# Altium schematic sheet [04] - REVISION HISTORY.SchDoc
size A3; DocumentNumber: 4; SheetNumber: 4; SheetTotal: 5
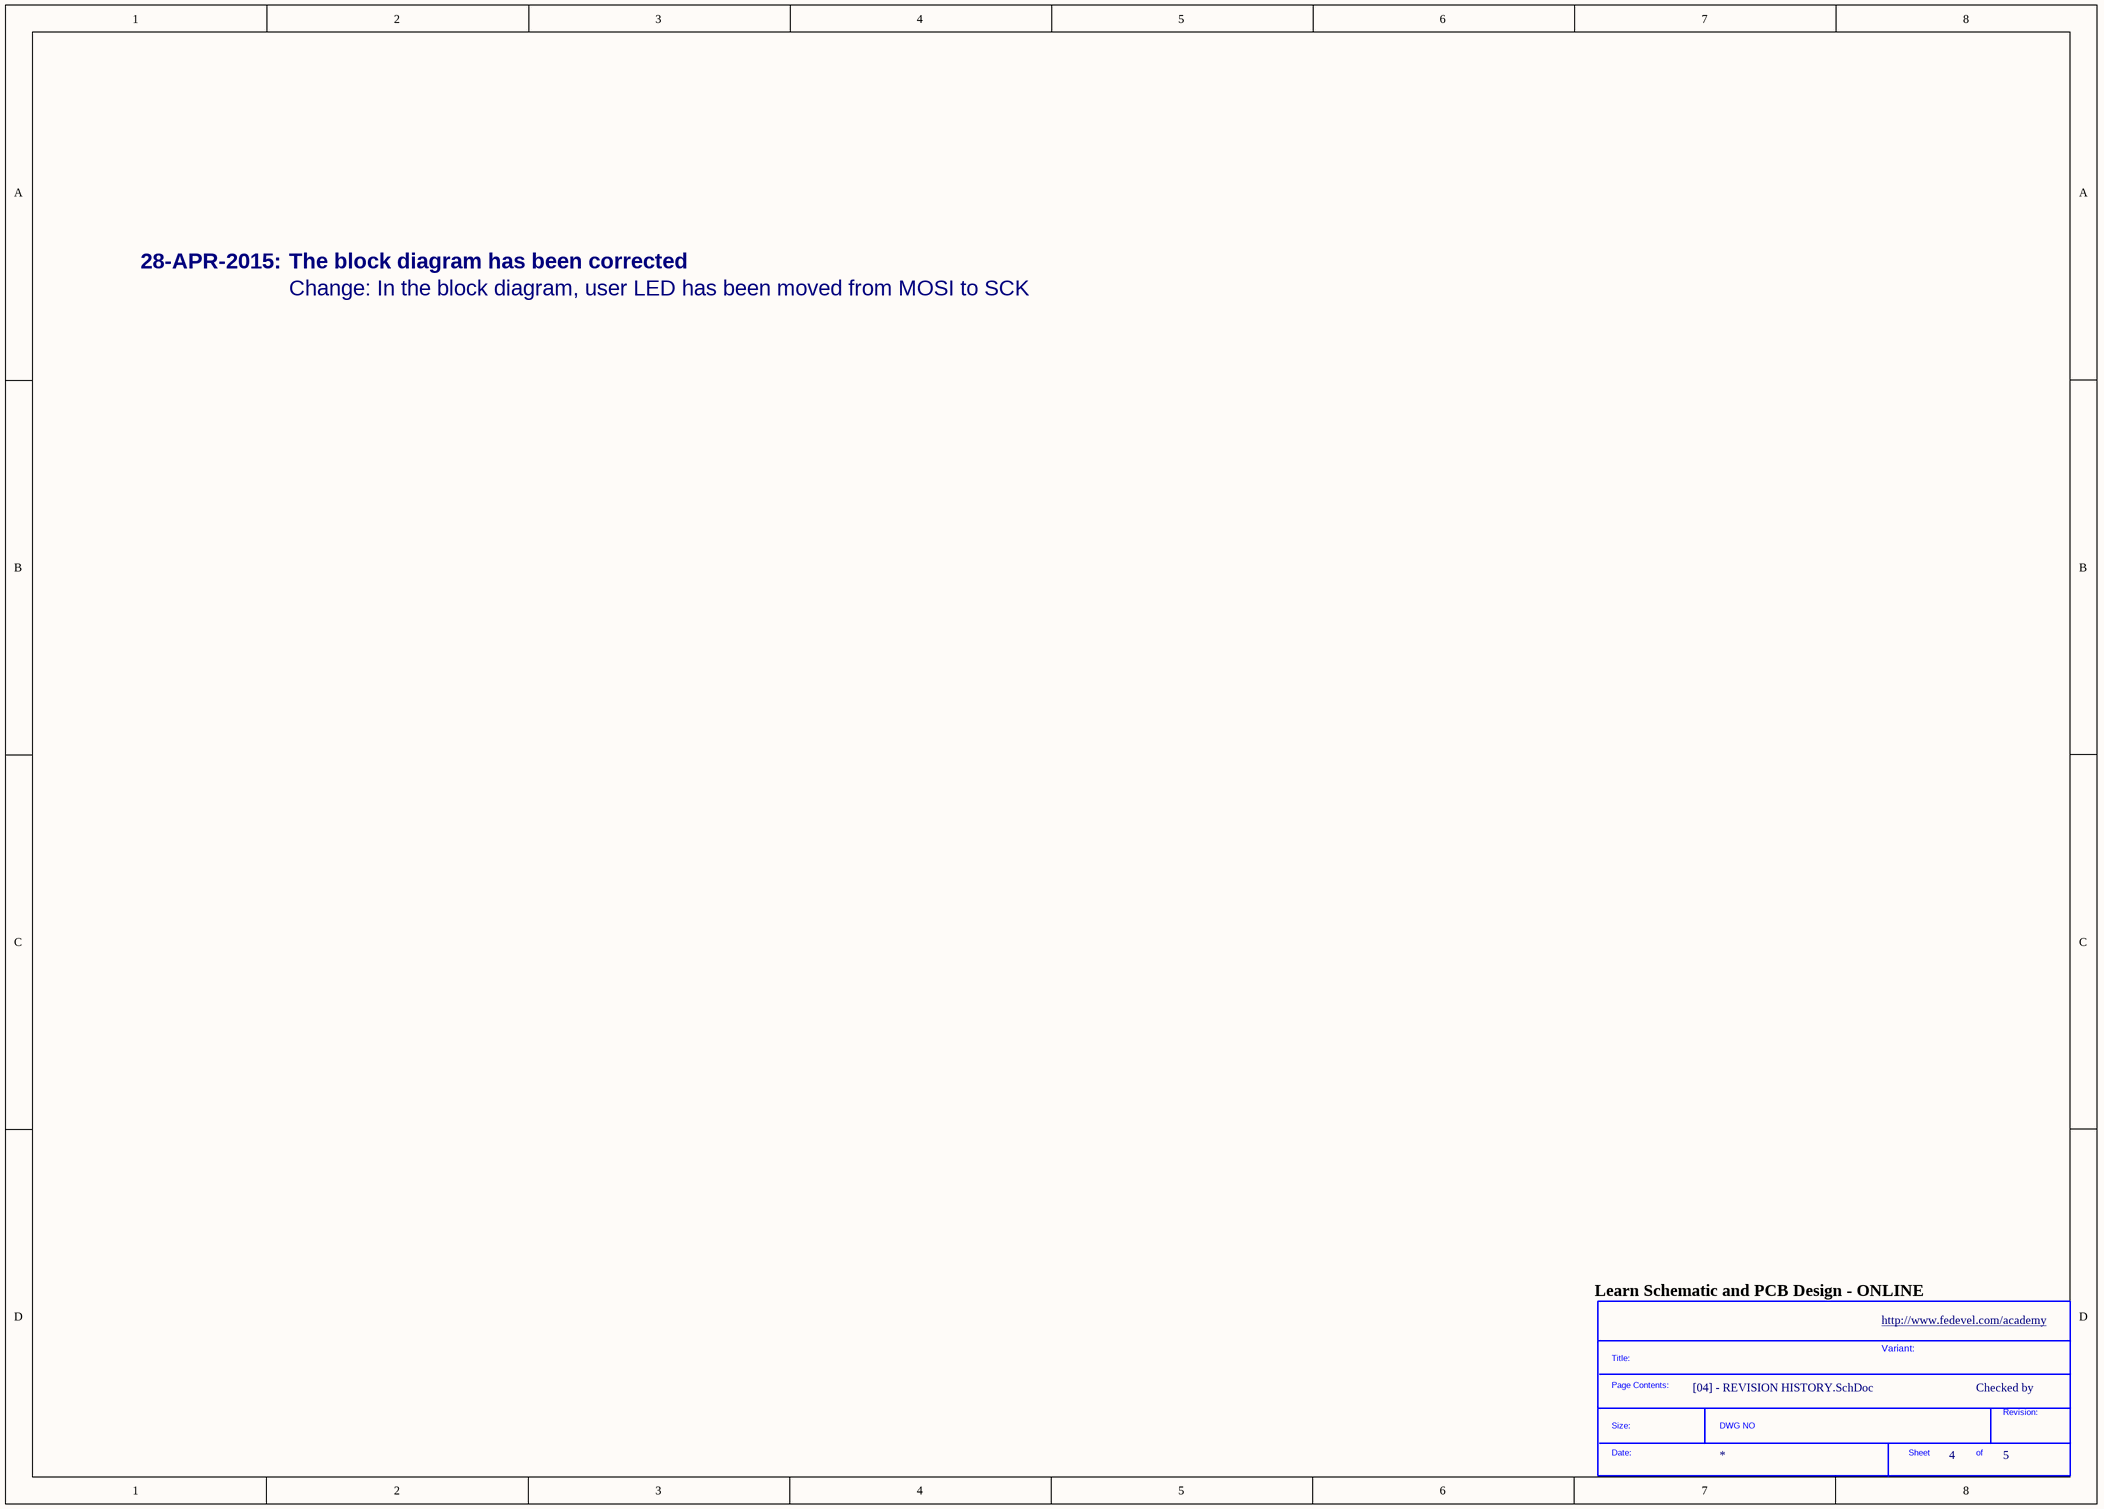
[diagram p0: [04] - REVISION HISTORY.SchDoc]

## Parts
*  SDTitleBlock  (value not drawn)  (graphical)

## Notes on the sheet
- 28-APR-2015:
- The block diagram has been corrected
- Change: In the block diagram, user LED has been moved from MOSI to SCK
- (near *) Learn Schematic and PCB Design - ONLINE
- http://www.fedevel.com/academy
- Variant:
- Checked by
- (in symbol SDTitleBlock) Title:; Page Contents:; Revision:; Size:; DWG NO; Date:; Sheet; of